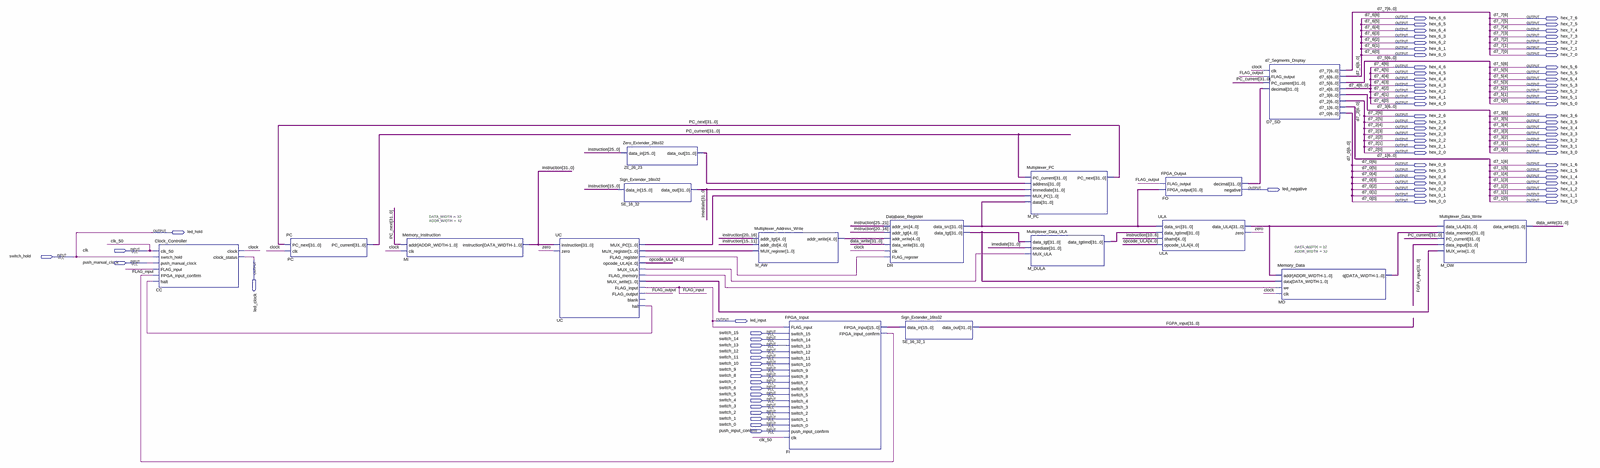
[diagram p0: schematic sheet, whole]
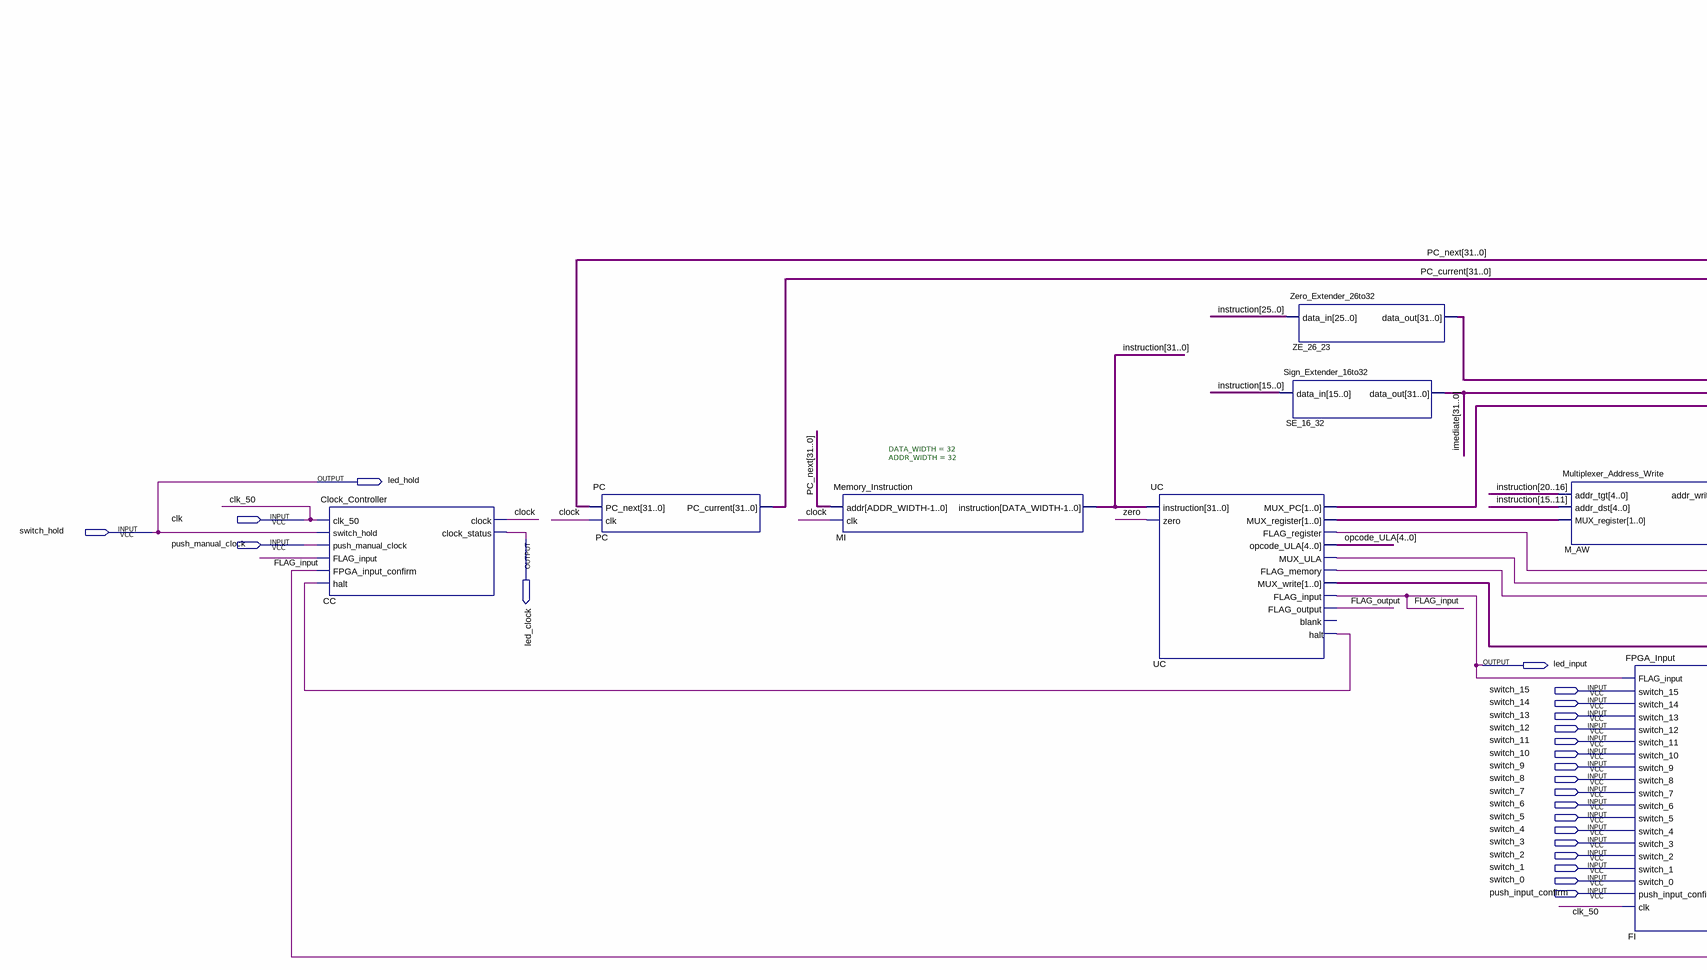
[diagram p1: schematic sheet, left part]
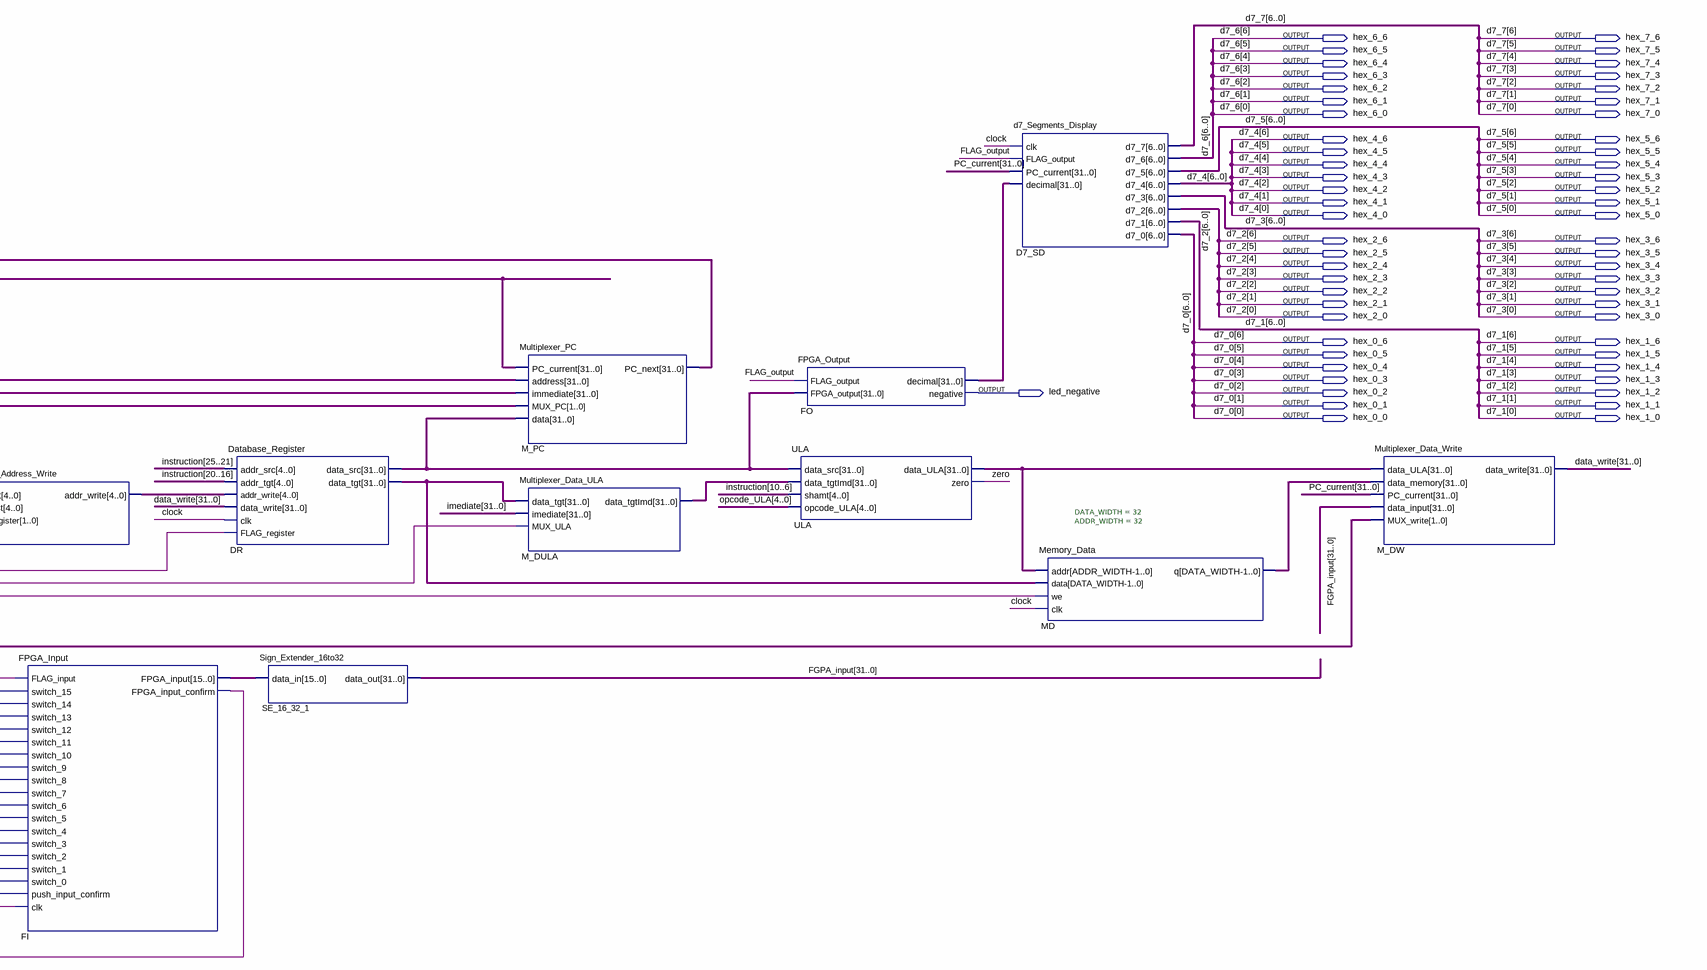
[diagram p2: schematic sheet, right part]
// Quartus schematic MIPS_Schematic.bdf as structural Verilog: 17 symbols, 80 pins
module MIPS_Schematic (
  input  clk,
  input  switch_hold,
  input  push_manual_clock,
  input  switch_15,
  input  switch_14,
  input  switch_13,
  input  switch_12,
  input  switch_11,
  input  switch_10,
  input  switch_9,
  input  switch_8,
  input  switch_7,
  input  switch_6,
  input  switch_5,
  input  switch_4,
  input  switch_3,
  input  switch_2,
  input  switch_1,
  input  switch_0,
  input  push_input_confirm,
  output hex_6_6,
  output hex_7_6,
  output hex_6_5,
  output hex_7_5,
  output hex_6_4,
  output hex_7_4,
  output hex_6_3,
  output hex_7_3,
  output hex_6_2,
  output hex_7_2,
  output hex_6_1,
  output hex_7_1,
  output hex_6_0,
  output hex_7_0,
  output hex_4_6,
  output hex_5_6,
  output hex_4_5,
  output hex_5_5,
  output hex_4_4,
  output hex_5_4,
  output hex_4_3,
  output hex_5_3,
  output hex_4_2,
  output hex_5_2,
  output hex_4_1,
  output hex_5_1,
  output hex_4_0,
  output hex_5_0,
  output hex_2_6,
  output hex_3_6,
  output hex_2_5,
  output hex_3_5,
  output hex_2_4,
  output hex_3_4,
  output hex_2_3,
  output hex_3_3,
  output hex_2_2,
  output hex_3_2,
  output hex_2_1,
  output hex_3_1,
  output hex_2_0,
  output hex_3_0,
  output hex_0_6,
  output hex_1_6,
  output hex_0_5,
  output hex_1_5,
  output hex_0_4,
  output hex_1_4,
  output hex_0_3,
  output hex_1_3,
  output led_negative,
  output hex_0_2,
  output hex_1_2,
  output hex_0_1,
  output hex_1_1,
  output hex_0_0,
  output hex_1_0,
  output led_hold,
  output led_clock,
  output led_input
);

  wire clock, FI_fpga_input_confirm, FLAG_output, UC_flag_memory, UC_flag_register, UC_halt, UC_mux_ula, zero;
  wire [1:0] UC_mux_pc, UC_mux_register, UC_mux_write;
  wire [4:0] M_AW_addr_write, opcode_ULA;
  wire [15:0] FI_fpga_input;
  wire [31:0] data_write, DR_data_src, DR_data_tgt, FGPA_input, FO_decimal, imediate, instruction,
       M_DULA_data_tgtimd, MD_q, PC_current, PC_next, ULA_data_ula, ZE_26_23_data_out;

  Clock_Controller CC (
    .clk_50(clk), .switch_hold(switch_hold), .push_manual_clock(push_manual_clock), .FLAG_input(led_input),
    .FPGA_input_confirm(FI_fpga_input_confirm), .halt(UC_halt), .clock(clock), .clock_status(led_clock));
  PC PC (.PC_next(PC_next), .clk(clock), .PC_current(PC_current));
  Memory_Instruction #(.DATA_WIDTH(32), .ADDR_WIDTH(32)) MI (.addr(PC_next), .clk(clock), .instruction(instruction));
  UC UC (
    .instruction(instruction), .zero(zero), .MUX_PC(UC_mux_pc), .MUX_register(UC_mux_register),
    .FLAG_register(UC_flag_register), .opcode_ULA(opcode_ULA), .MUX_ULA(UC_mux_ula),
    .FLAG_memory(UC_flag_memory), .MUX_write(UC_mux_write), .FLAG_input(led_input),
    .FLAG_output(FLAG_output), .halt(UC_halt));  // open: blank
  Zero_Extender_26to32 ZE_26_23 (.data_in(instruction[25:0]), .data_out(ZE_26_23_data_out));
  Sign_Extender_16to32 SE_16_32 (.data_in(instruction[15:0]), .data_out(imediate));
  Multiplexer_Address_Write M_AW (
    .addr_tgt(instruction[20:16]), .addr_dst(instruction[15:11]), .MUX_register(UC_mux_register),
    .addr_write(M_AW_addr_write));
  FPGA_Input FI (
    .FLAG_input(led_input), .switch_15(switch_15), .switch_14(switch_14), .switch_13(switch_13),
    .switch_12(switch_12), .switch_11(switch_11), .switch_10(switch_10), .switch_9(switch_9),
    .switch_8(switch_8), .switch_7(switch_7), .switch_6(switch_6), .switch_5(switch_5), .switch_4(switch_4),
    .switch_3(switch_3), .switch_2(switch_2), .switch_1(switch_1), .switch_0(switch_0),
    .push_input_confirm(push_input_confirm), .clk(clk), .FPGA_input(FI_fpga_input),
    .FPGA_input_confirm(FI_fpga_input_confirm));
  Database_Register DR (
    .addr_src(instruction[25:21]), .addr_tgt(instruction[20:16]), .addr_write(M_AW_addr_write),
    .data_write(data_write), .clk(clock), .FLAG_register(UC_flag_register), .data_src(DR_data_src),
    .data_tgt(DR_data_tgt));
  Sign_Extender_16to32 SE_16_32_1 (.data_in(FI_fpga_input), .data_out(FGPA_input));
  Multiplexer_PC M_PC (
    .PC_current(PC_current), .address(ZE_26_23_data_out), .immediate(imediate), .MUX_PC(UC_mux_pc),
    .data(DR_data_src), .PC_next(PC_next));
  Multiplexer_Data_ULA M_DULA (
    .data_tgt(DR_data_tgt), .imediate(imediate), .MUX_ULA(UC_mux_ula), .data_tgtImd(M_DULA_data_tgtimd));
  FPGA_Output FO (.FLAG_output(FLAG_output), .FPGA_output(DR_data_src), .decimal(FO_decimal), .negative(led_negative));
  ULA ULA (
    .data_src(DR_data_src), .data_tgtImd(M_DULA_data_tgtimd), .shamt(instruction[10:6]),
    .opcode_ULA(opcode_ULA), .data_ULA(ULA_data_ula), .zero(zero));
  d7_Segments_Display D7_SD (
    .clk(clock), .FLAG_output(FLAG_output), .PC_current(PC_current), .decimal(FO_decimal),
    .d7_7({hex_7_6, hex_7_5, hex_7_4, hex_7_3, hex_7_2, hex_7_1, hex_7_0}),
    .d7_6({hex_6_6, hex_6_5, hex_6_4, hex_6_3, hex_6_2, hex_6_1, hex_6_0}),
    .d7_5({hex_5_6, hex_5_5, hex_5_4, hex_5_3, hex_5_2, hex_5_1, hex_5_0}),
    .d7_4({hex_4_6, hex_4_5, hex_4_4, hex_4_3, hex_4_2, hex_4_1, hex_4_0}),
    .d7_3({hex_3_6, hex_3_5, hex_3_4, hex_3_3, hex_3_2, hex_3_1, hex_3_0}),
    .d7_2({hex_2_6, hex_2_5, hex_2_4, hex_2_3, hex_2_2, hex_2_1, hex_2_0}),
    .d7_1({hex_1_6, hex_1_5, hex_1_4, hex_1_3, hex_1_2, hex_1_1, hex_1_0}),
    .d7_0({hex_0_6, hex_0_5, hex_0_4, hex_0_3, hex_0_2, hex_0_1, hex_0_0}));
  Memory_Data #(.DATA_WIDTH(32), .ADDR_WIDTH(32)) MD (
    .addr(ULA_data_ula), .data(DR_data_tgt), .we(UC_flag_memory), .clk(clock), .q(MD_q));
  Multiplexer_Data_Write M_DW (
    .data_ULA(ULA_data_ula), .data_memory(MD_q), .PC_current(PC_current), .data_input(FGPA_input),
    .MUX_write(UC_mux_write), .data_write(data_write));

  assign led_hold = switch_hold;

  // Other names for the same wires on the sheet: clk_50 = clk;
  //   d7_0[6:0] = {hex_0_6, hex_0_5, hex_0_4, hex_0_3, hex_0_2, hex_0_1, hex_0_0};
  //   d7_1[6:0] = {hex_1_6, hex_1_5, hex_1_4, hex_1_3, hex_1_2, hex_1_1, hex_1_0};
  //   d7_2[6:0] = {hex_2_6, hex_2_5, hex_2_4, hex_2_3, hex_2_2, hex_2_1, hex_2_0};
  //   d7_3[6:0] = {hex_3_6, hex_3_5, hex_3_4, hex_3_3, hex_3_2, hex_3_1, hex_3_0};
  //   d7_4[6:0] = {hex_4_6, hex_4_5, hex_4_4, hex_4_3, hex_4_2, hex_4_1, hex_4_0};
  //   d7_5[6:0] = {hex_5_6, hex_5_5, hex_5_4, hex_5_3, hex_5_2, hex_5_1, hex_5_0};
  //   d7_6[6:0] = {hex_6_6, hex_6_5, hex_6_4, hex_6_3, hex_6_2, hex_6_1, hex_6_0};
  //   d7_7[6:0] = {hex_7_6, hex_7_5, hex_7_4, hex_7_3, hex_7_2, hex_7_1, hex_7_0}; FLAG_input = led_input
endmodule
